# Altium project BackBoom.PrjPcb
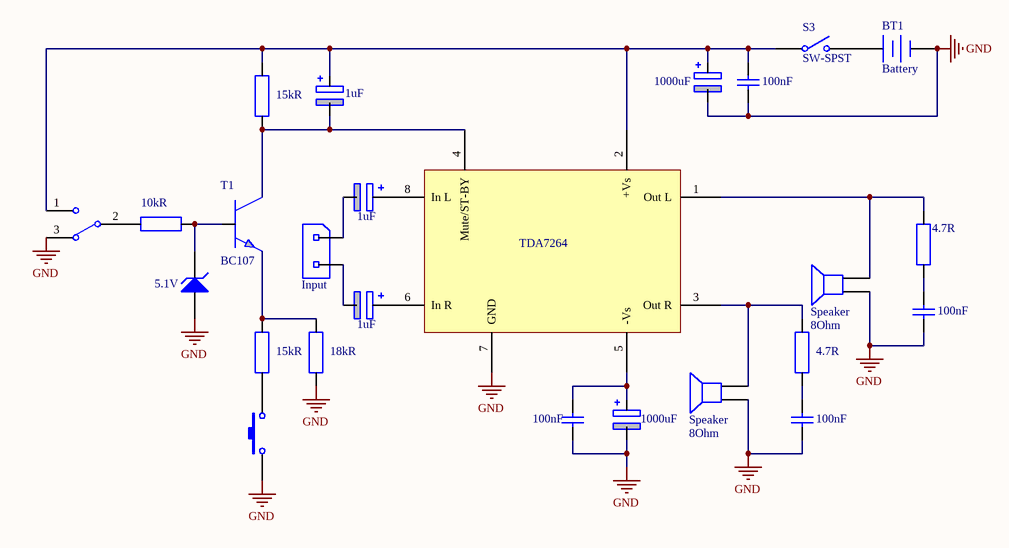
[diagram p0: BackBoomSchem.SchDoc]
1 sheet, 25 parts. Net scope: global (net labels, ports and power ports of the same name join across sheets).
Board file: BackBoomPcb.PcbDoc

## Sheet BackBoomSchem.SchDoc
size A4

### Parts
BT1  Battery  [BAT-2]
C1  value 1uF  [cap 48 pol (.46/.2/.6/125/36)]  (hidden comment: Cap)
C2  value 1uF  [cap 48 pol (.46/.2/.6/125/36)]  (hidden comment: Cap)
C3  value 1uF  [cap 48 pol (.46/.2/.6/125/36)]  (hidden comment: Cap)
C4  value 1000uF  [cap 48 pol (.46/.2/.6/125/36)]  (hidden comment: Cap)
C5  100nF  [RAD-0.3]
C6  value 1000uF  [cap 48 pol (.46/.2/.6/125/36)]  (hidden comment: Cap)
C7  value 100nF  [RAD-0.3]  (hidden comment: Cap)
C8  value 100nF  [RAD-0.3]  (hidden comment: Cap)
C9  value 100nF  [RAD-0.3]  (hidden comment: Cap)
D1  value 5.1V  [DIODE-0.7]  (hidden comment: D Zener)
In  Input  [hdr 1x2]
LS_L  Speaker  Internal Resistance: 8Ohm  [PIN2]
LS_R  Speaker  Internal Resistance: 8Ohm  [PIN2]
R1  value 10kR  [ws 0.6W H]  (hidden comment: Res)
R2  value 15kR  [ws 0.6W H]  (hidden comment: Res)
R3  value 18kR  [ws 0.6W H]  (hidden comment: Res)
R4  value 15kR  [ws 0.6W H]  (hidden comment: Res)
R5  value 4.7R  [ws 0.6W H]  (hidden comment: Res)
R6  value 4.7R  [ws 0.6W H]  (hidden comment: Res)
S1  SW-SPDT  [TL36WW15050]  (value not drawn)
S2  SW-PB  [SPST-2]  (value not drawn)
S3  SW-SPST  [SPST-2]
T1  BC107  [TO-18]
TDA7264  TDA7264 stereo audio amplifier  [MultiWatt8]  (value not drawn)

### Nets
GND: BT1.2(-) C4.2 C5.1 C6.2 C7.1 C8.1 C9.1 D1.1(A) LS_L.1 LS_R.1 R3.1 S1.3 S2.1 TDA7264.7(GND)
NetBT1_1: BT1.1(+) S3.2(NO)
NetC1_1: C1.1 TDA7264.8(In_L)
NetC1_2: C1.2 In.1
NetC2_1: C2.1 TDA7264.6(In_R)
NetC2_2: C2.2 In.2
NetC3_1: C3.1 C4.1 C5.2 R2.2 S1.1 S3.1(COMMON) TDA7264.2(+Vs)
NetC3_2: C3.2 R2.1 T1.3 TDA7264.4(Mute/ST-BY)
NetC6_1: C6.1 C7.2 TDA7264.5(-Vs)
NetC8_2: C8.2 R5.2
NetC9_2: C9.2 R6.1
NetD1_2: D1.2(K) R1.1 T1.2
NetLS_L_2: LS_L.2 R5.1 TDA7264.1(Out_L)
NetLS_R_2: LS_R.2 R6.2 TDA7264.3(Out_R)
NetR1_2: R1.2 S1.2
NetR3_2: R3.2 R4.2 T1.1
NetR4_1: R4.1 S2.2

### Library data of the parts
BT1 = Battery: Multicell Battery; Published: 24-Mar-1999; LatestRevisionDate: 17-Jul-2002; LatestRevisionNote: Re-released for DXP Platform.; PackageReference: BAT-2; Publisher: Altium Limited; PackageDescription: Battery; 2 Leads
C1-C4 C6 = CECA0.47uF/63V: elektrolytische condensator axiaal 0.47uF/63V; Part Number: CECA0.47uF/63V; Component Kind: Standard; Component Type: Standard; Designator: CECA0.47uF/63V; Pin Count: 2
C5 C7-C9 = Cap: Capacitor; Published: 8-Jun-2000; LatestRevisionDate: 17-Jul-2002; LatestRevisionNote: Re-released for DXP Platform.; PackageReference: RAD-0.3; Publisher: Altium Limited; PackageDescription: Radial Cap, Thru-Hole; 2 Leads; 0.3 in Pin Spacing
D1 = D Zener: Zener Diode; Published: 8-Jun-2000; LatestRevisionDate: 17-Jul-2002; LatestRevisionNote: Re-released for DXP Platform.; PackageReference: DIODE-0.7; Publisher: Altium Limited; PackageDescription: Diode, Thru-Hole; 2 Leads; 0.7 in Pin Spacing
In = CON HDR 1x2: pcb header recht 1x2  pitch 100mil; Part Number: CON HDR 1x2; Component Kind: Standard; Component Type: Standard; Designator: CON HDR 1x2; Pin Count: 2
LS_L LS_R = Speaker: Loudspeaker; Published: 24-Mar-1999; LatestRevisionDate: 17-Jul-2002; LatestRevisionNote: Re-released for DXP Platform.; PackageReference: PIN2; Publisher: Altium Limited
R1-R6 = 0R2: weerstand 0R2 0.6W
S1 = SW-SPDT: SPDT Subminiature Toggle Switch, Right Angle Mounting, Vertical Actuation; Published: 24-Mar-1999; LatestRevisionDate: 17-Dec-2003; LatestRevisionNote: Schematic revised, PCB Footprint replaced.; DatasheetVersion: 05-Dec-2000; PackageReference: TL36WW15050; Publisher: Altium Limited; PackageDescription: Switch; 4 Leads; ComponentLink1Description: Manufacturer Link; ComponentLink1URL: http://www.apem.com
S2 = SW-PB: Switch; Published: 24-Mar-1999; LatestRevisionDate: 17-Jul-2002; LatestRevisionNote: Re-released for DXP Platform.; PackageReference: SPST-2; Publisher: Altium Limited; PackageDescription: Switch; 2 Leads
S3 = SW-SPST: Single-Pole, Single-Throw Switch; Published: 24-Mar-1999; LatestRevisionDate: 17-Jul-2002; LatestRevisionNote: Re-released for DXP Platform.; PackageReference: SPST-2; Publisher: Altium Limited; PackageDescription: Switch; 2 Leads
T1 = BC107: NPN transistor
TDA7264 = TDA7264 stereo audio amplifier: 25 W + 25 W stereo amplifier with mute and standby